# Altium schematic sheet Power Controller V1.0.SchDoc
size A4
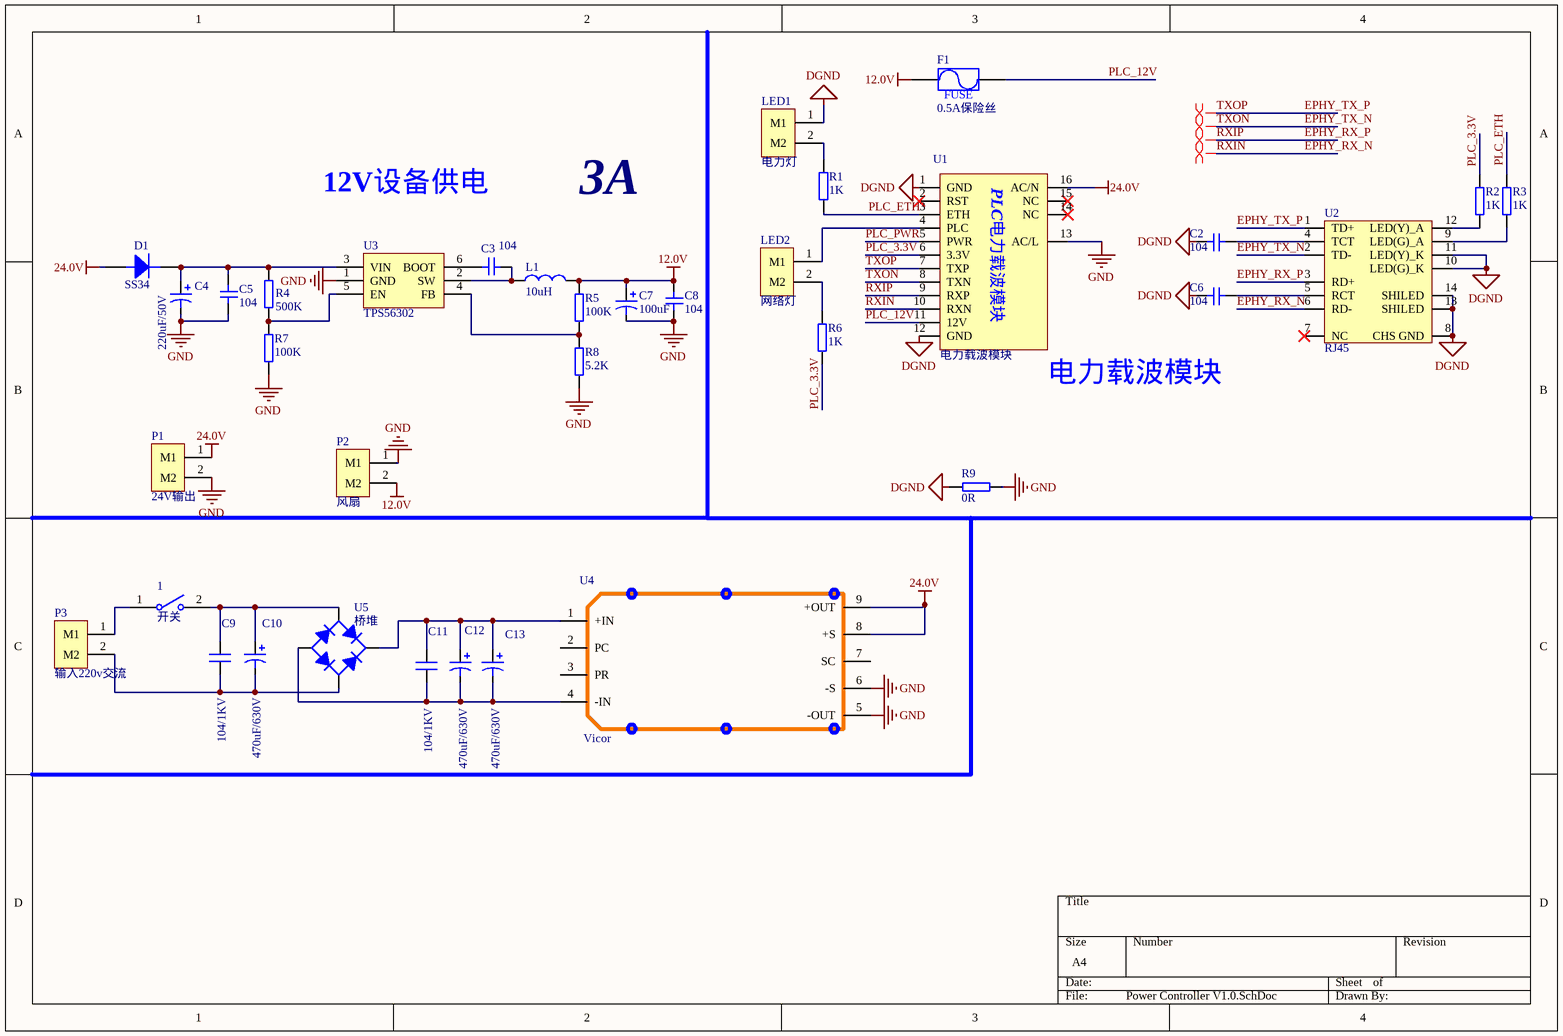
[diagram p0: Power Controller V1.0.SchDoc]

## Parts
1  开关  [XT60-F]
C2  104  [0805C]
C3  104  [0805C]
C4  220uF/50V  [RB.1.2]
C5  104  [0805C]
C6  104  [0805C]
C7  100uF  [TAJ-C]
C8  104  [0805C]
C9  104/1KV  [无极性直插电容]
C10  470uF/630V  [RB.2.4]
C11  104/1KV  [无极性直插电容]
C12  470uF/630V  [RB.2.4]
C13  470uF/630V  [RB.2.4]
D1  SS34  [SMA/DO-214AC]
F1  0.5A保险丝  [FUSE-1206]
L1  10uH  [CDRH124]
LED1  电力灯  [XH2/2.54mm/180]
LED2  网络灯  [XH2/2.54mm/180]
P1  24V输出  [XT60-F]
P2  风扇  [接线端子(2.54mm)-2PIN]
P3  输入220v交流  [XT60-F]
R1  1K  [0805R]
R2  1K  [0805R]
R3  1K  [0805R]
R4  500K  [0805R]
R5  100K  [0805R]
R6  1K  [0805R]
R7  100K  [0805R]
R8  5.2K  [0805R]
R9  0R  [0805R]
U1  电力载波模块  [电力载波模块6410]
U2  RJ45  [RJ45]
U3  TPS56302  [SOT23-6]
U4  Vicor  [vicor]
U5  桥堆  [整流全桥]

## Nets
12.0V: C7.1 C8.2 F1.1 L1.2 P2.2(M2) R5.2
24.0V: D1.1 P1.1(M1) U1.16(AC/N) U4.8(+S) U4.9(+OUT)
DGND: C2.1 C6.1 LED1.1(M1) R9.2 U1.1(GND) U1.12(GND) U2.8(CHS_GND) U2.10(LED(G)_K) U2.11(LED(Y)_K) U2.13(SHILED) U2.14(SHILED)
GND: C4.2 C5.1 C7.2 C8.1 P1.2(M2) P2.1(M1) R7.1 R8.1 R9.1 U1.13(AC/L) U3.1(GND) U4.5(-OUT) U4.6(-S)
EPHY_RX_N: U1.10(RXN) U2.6(RD-)  [also labelled RXIN]
EPHY_RX_P: U1.9(RXP) U2.3(RD+)  [also labelled RXIP]
EPHY_TX_N: U1.8(TXN) U2.2(TD-)  [also labelled TXON]
EPHY_TX_P: U1.7(TXP) U2.1(TD+)  [also labelled TXOP]
PLC_3.3V: R2.2 R6.1 U1.6(3.3V)
PLC_12V: F1.2 U1.11(12V)
PLC_ETH: R1.2 R3.1 U1.3(ETH)
PLC_PWR: U1.5(PWR)
Net1_1: 1.1 P3.1(M1)
Net1_2: 1.2 C9.2 C10.1 U5.AC1
NetC2_2: C2.2 U2.4(TCT)
NetC3_1: C3.1 L1.1 U3.2(SW)
NetC3_2: C3.2 U3.6(BOOT)
NetC4_1: C4.1 C5.2 D1.2 R4.2 U3.3(VIN)
NetC6_2: C6.2 U2.5(RCT)
NetC9_1: C9.1 C10.2 P3.2(M2) U5.AC2
NetC11_1: C11.1 C12.2 C13.2 U4.4(-IN) U5.DC-
NetC11_2: C11.2 C12.1 C13.1 U4.1(+IN) U5.DC+
NetLED1_2: LED1.2(M2) R1.1
NetLED2_1: LED2.1(M1) U1.4(PLC)
NetLED2_2: LED2.2(M2) R6.2
NetR2_1: R2.1 U2.12(LED(Y)_A)
NetR3_2: R3.2 U2.9(LED(G)_A)
NetR4_1: R4.1 R7.2 U3.5(EN)
NetR5_1: R5.1 R8.2 U3.4(FB)

Not connected (* = marked no-connect by the designer): U1 2(RST)* 14(NC)* 15(NC)*; U2 7(NC)*; U4 2(PC) 3(PR) 7(SC)

## Layout directives
differential pair: EPHY_RX_N, EPHY_RX_P, EPHY_TX_N, EPHY_TX_P

## Notes on the sheet
- 12V设备供电
- 3A
- (near U1) 电力载波模块
- (in symbol Fuse) FUSE
- (in symbol 电力载波模块6410) PLC电力载波模块

## Library data of the parts
C2 C3 C5 C6 C8 = Cap1: 无极贴片电容
C4 C10 C12 C13 = Cap3: 直插极性电容
C7 = Pol Cap: 极性贴片电容
C9 C11 = Cap2: 无极直插电容
D1 = Diode: 二极管
F1 = Fuse: 保险丝
L1 = L: 电感
LED1 LED2 P1-P3 = 接线端子-2PIN: 2PIN
R1-R9 = Res: 电阻
U1 = 电力载波模块6410
U3 = TPS54302
U4 = 滨达模块（220V--24V）